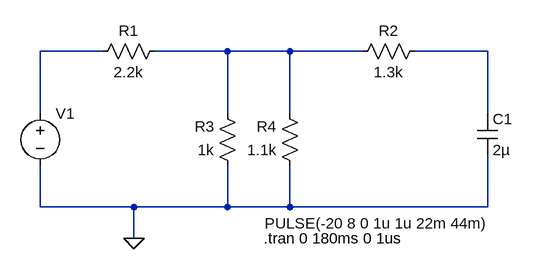
[diagram p0: schematic Question_1.asc]
Question_1.asc, the LTspice schematic file:
Version 4
SHEET 1 880 680
WIRE 176 272 80 272
WIRE 368 272 256 272
WIRE 464 272 368 272
WIRE 576 272 464 272
WIRE 768 272 656 272
WIRE 80 368 80 272
WIRE 368 368 368 272
WIRE 464 368 464 272
WIRE 768 368 768 272
WIRE 80 512 80 448
WIRE 224 512 80 512
WIRE 368 512 368 448
WIRE 368 512 224 512
WIRE 464 512 464 448
WIRE 464 512 368 512
WIRE 768 512 768 432
WIRE 768 512 464 512
WIRE 224 560 224 512
FLAG 224 560 0
SYMBOL res 272 256 R90
WINDOW 0 0 56 VBottom 2
WINDOW 3 32 56 VTop 2
SYMATTR InstName R1
SYMATTR Value 2.2k
SYMBOL res 672 256 R90
WINDOW 0 0 56 VBottom 2
WINDOW 3 32 56 VTop 2
SYMATTR InstName R2
SYMATTR Value 1.3k
SYMBOL res 384 464 R180
WINDOW 0 36 76 Left 2
WINDOW 3 36 40 Left 2
SYMATTR InstName R3
SYMATTR Value 1k
SYMBOL res 480 464 R180
WINDOW 0 36 76 Left 2
WINDOW 3 36 40 Left 2
SYMATTR InstName R4
SYMATTR Value 1.1k
SYMBOL cap 752 368 R0
SYMATTR InstName C1
SYMATTR Value 2µ
SYMBOL voltage 80 352 R0
WINDOW 3 345 185 Left 2
SYMATTR InstName V1
SYMATTR Value PULSE(-20 8 0 1u 1u 22m 44m)
TEXT 424 560 Left 2 !.tran 0 180ms 0 1us

The netlist it stands for:
* Question_1.asc
R1 N002 N001 2.2k
R2 N003 N002 1.3k
R3 0 N002 1k
R4 0 N002 1.1k
C1 N003 0 2µ
V1 N001 0 PULSE(-20 8 0 1u 1u 22m 44m)
.tran 0 180ms 0 1us
.backanno
.end